# EAGLE design I2C-dluga-linia (EAGLE 7.3.0)
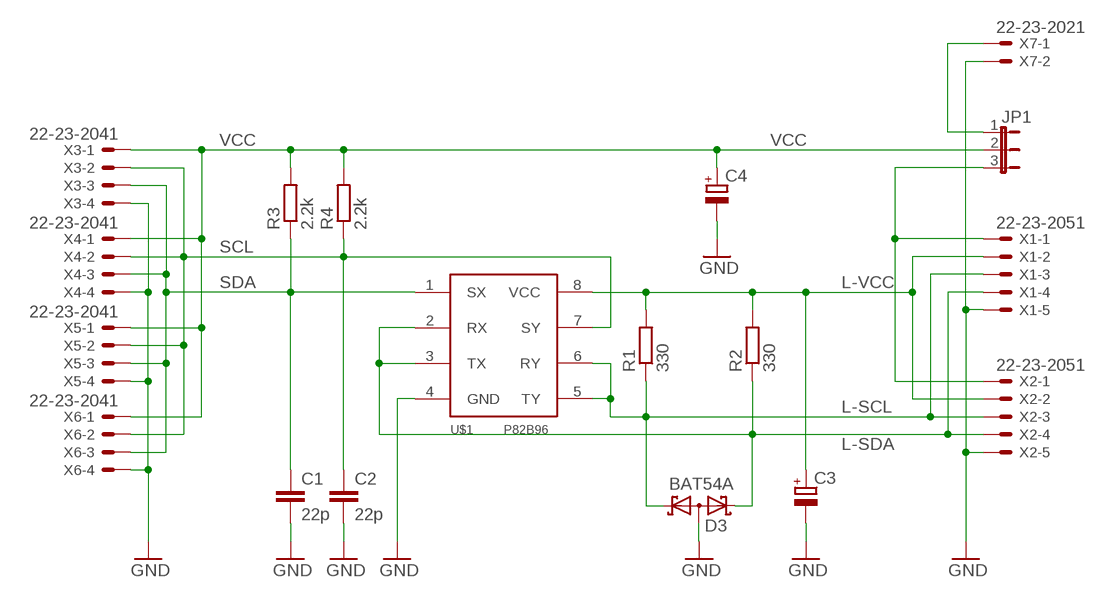
[diagram p0: schematic, sheet 1]

## Parts
C1  22p  C-EUC1206  [C1206]
C2  22p  C-EUC1206  [C1206]
C3  CPOL-EUE5-10.5  [E5-10,5]
C4  CPOL-EUE3.5-8  [E3,5-8]
D3  BAT54A  [SOT23]
JP1  JP2E  [JP2]
R1  330  R-EU_R1206  [R1206]
R2  330  R-EU_R1206  [R1206]
R3  2.2k  R-EU_R1206  [R1206]
R4  2.2k  R-EU_R1206  [R1206]
U$1  P82B96  [SOIC8]
X1  22-23-2051  [22-23-2051]
X2  22-23-2051  [22-23-2051]
X3  22-23-2041  [22-23-2041]
X4  22-23-2041  [22-23-2041]
X5  22-23-2041  [22-23-2041]
X6  22-23-2041  [22-23-2041]
X7  22-23-2021  [22-23-2021]

## Nets
GND: C1.2 C2.2 C3.- C4.- D3.3(AA) U$1.4(GND) X1.5 X2.5 X3.4 X4.4 X5.4 X6.4 X7.2
L-SCL: D3.1(K1) R1.1 U$1.5(TY) U$1.6(RY) X1.3 X2.3
L-SDA: D3.2(K2) R2.1 U$1.2(RX) U$1.3(TX) X1.4 X2.4
L-VCC: C3.+ R1.2 R2.2 U$1.8(VCC) X1.2 X2.2
N$1: JP1.3 X1.1 X2.1
N$2: JP1.1 X7.1
SCL: C2.1 R4.1 U$1.7(SY) X3.2 X4.2 X5.2 X6.2
SDA: C1.1 R3.1 U$1.1(SX) X3.3 X4.3 X5.3 X6.3
VCC: C4.+ JP1.2 R3.2 R4.2 X3.1 X4.1 X5.1 X6.1

## Library data of the parts
C1 C2 = rcl:C-EU: CAPACITOR, European symbol
C3 C4 = rcl:CPOL-EU: POLARIZED CAPACITOR, European symbol
D3 = diode:BAT54A: Schottky Diodes Source: Fairchild .. BAT54.pdf
JP1 = jumper:JP2E: JUMPER
R1-R4 = resistor:R-EU_: RESISTOR, European symbol
U$1 = P82B96:P82B96: P82B96 - I2C buffer
X1 X2 = con-molex:22-23-2051: .100" (2.54mm) Center Header - 5 Pin; MF: MOLEX; MPN: 22-23-2051; OC_FARNELL: 1462952; OC_NEWARK: 38C9178
X3-X6 = con-molex:22-23-2041: .100" (2.54mm) Center Header - 4 Pin; MF: MOLEX; MPN: 22-23-2041; OC_FARNELL: 1462920; OC_NEWARK: 38C0355
X7 = con-molex:22-23-2021: .100" (2.54mm) Center Header - 2 Pin; MF: MOLEX; MPN: 22-23-2021; OC_FARNELL: 1462926; OC_NEWARK: 25C3832

## Board
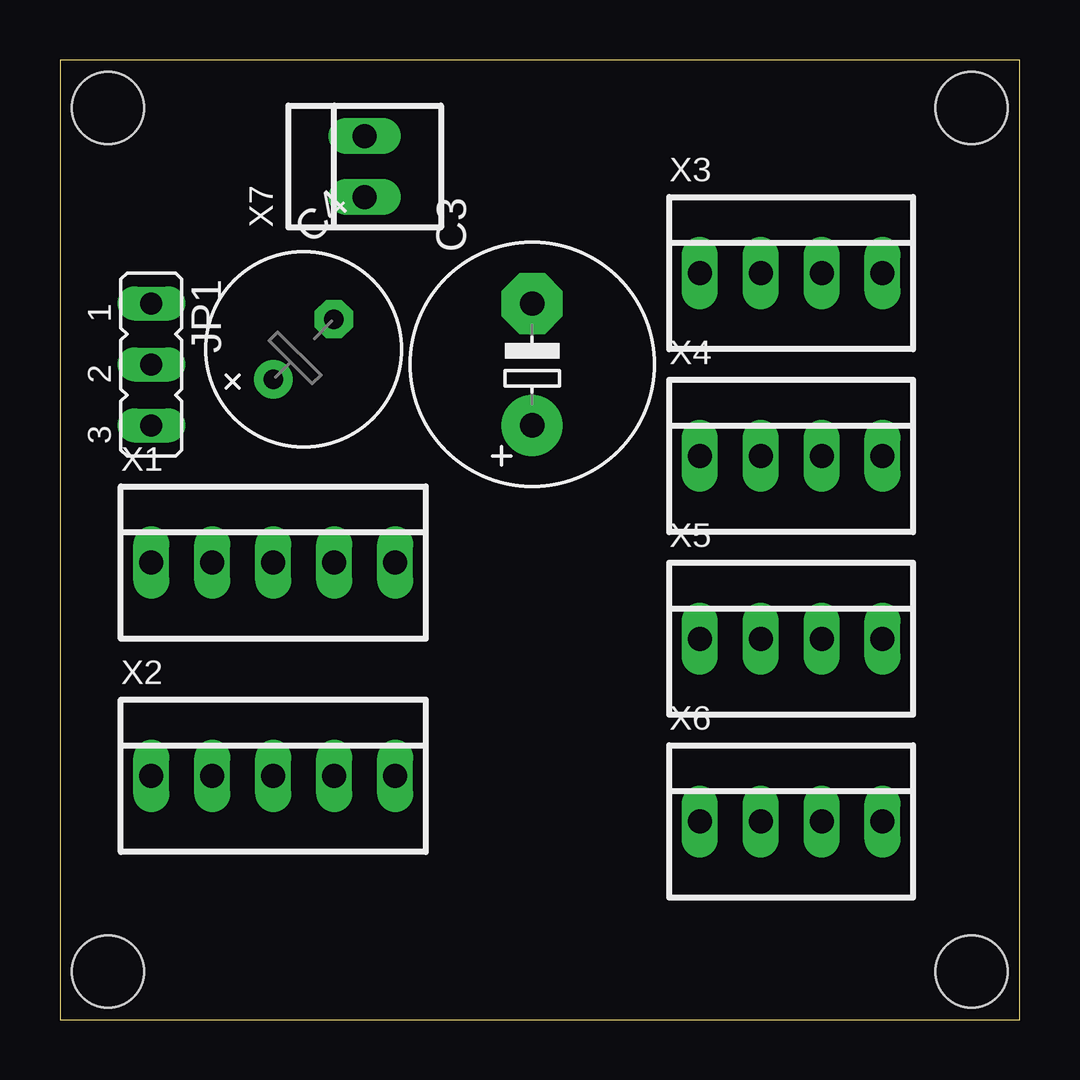
[diagram p1: board, top side]
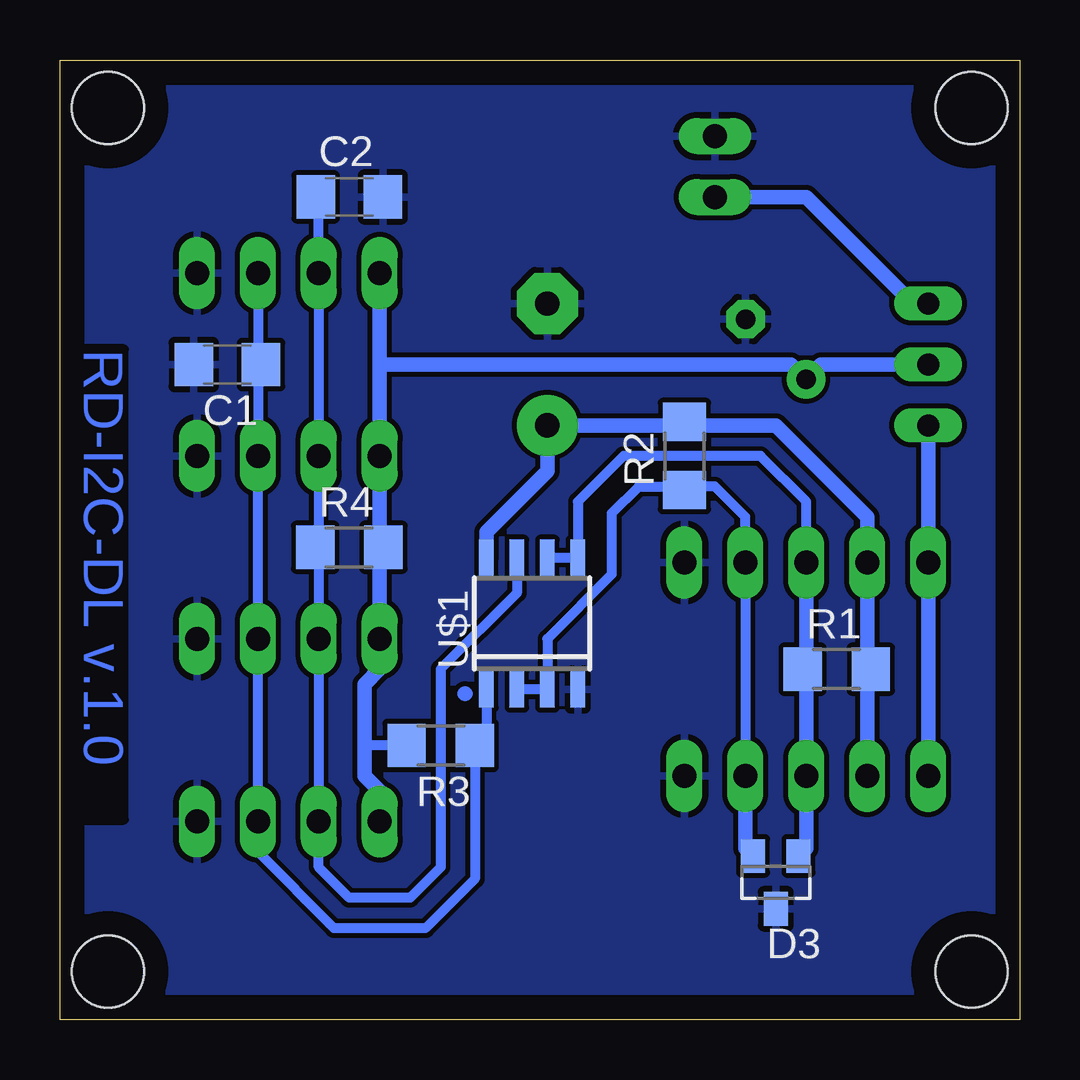
[diagram p2: board, bottom side, seen from below]

Size 40 x 40 mm. Coordinates in mm from the lower left corner, seen from the top.
Outline: 0,0 40,0 40,40 0,40 0,0
Copper layers (1*16): Top 0.035mm / dielectric 1.5mm / Bottom 0.035mm
Design rules "default *": minimum track width 10mil, minimum drill 24mil, track to track 8mil, track to pad 8mil, pad to pad 8mil, via to via 8mil, smd to smd 8mil, copper to edge 40mil, drill to drill 8mil, minimum pad ring 10mil, minimum via ring 8mil, stop-mask expansion 4mil, vias tented up to drill 0mil, thermal gap 10mil
Holes 3 mm at 2,2 2,38 38,38 38,2

### Footprints (pad centres in the part's own frame; a part is rotated, then mirrored left to right if it is on the bottom)
C1206 = smd 1.6 x 1.8: 1 -1.4,0; 2 1.4,0
E5-10,5 = drill 1.016 pad 2.54: + -2.54,0 | drill 1.016 pad 2.54 octagon: - 2.54,0
E3,5-8 = drill 0.813 pad 1.6: + -1.778,0 | drill 0.813 pad 1.6 octagon: - 1.778,0
SOT23 = smd 1 x 1.4: 1 -0.95,-1.1; 2 0.95,-1.1; 3 0,1.1
JP2 = drill 0.914 long: 1 -2.54,0; 2 0,0; 3 2.54,0
R1206 = smd 1.6 x 1.803: 1 -1.422,0; 2 1.422,0
SOIC8 = smd 0.6 x 1.5: 1 -1.905,-2.75; 2 -0.635,-2.75; 3 0.635,-2.75; 4 1.905,-2.75; 5 1.905,2.75; 6 0.635,2.75; 7 -0.635,2.75; 8 -1.905,2.75
22-23-2051 = drill 1 long: 1 -5.08,0; 2 -2.54,0; 3 0,0; 4 2.54,0; 5 5.08,0
22-23-2041 = drill 1 long: 1 -3.81,0; 2 -1.27,0; 3 1.27,0; 4 3.81,0
22-23-2021 = drill 1 long: 1 -1.27,0; 2 1.27,0

### Placement (x,y rotation side)
C1  33.02,27.3 180 bottom
C2  27.94,34.29 0 bottom
C3  19.68,27.3 90 top
C4  10.16,27.94 45 top
D3  10.16,5.71 180 bottom
JP1  3.81,27.3 270 top
R1  7.62,14.61 0 bottom
R2  13.97,23.5 90 bottom
R3  24.13,11.43 180 bottom
R4  27.94,19.68 0 bottom
U$1  20.32,16.51 0 bottom
X1  8.89,19.05 0 top
X2  8.89,10.16 0 top
X3  30.48,31.11 0 top
X4  30.48,23.5 0 top
X5  30.48,15.88 0 top
X6  30.48,8.26 0 top
X7  12.7,35.56 90 top

### Tracks (layer width: path | path; a pad name or v marks a point on that pad's centre or on a via)
GND
  pour Bottom: -0.64,40.64 -0.64,-0.64 40.64,-0.64 40.64,40.64
L-SCL
  Bottom 0.406: U$1.6 U$1.5 18.41,21.59 16.51,23.5 10.79,23.5 8.89,21.59 X1.3
  Bottom 0.61: X1.3 8.89,14.76 R1.1 8.89,14.45 X2.3 8.89,7.13 D3.1
L-SDA
  Bottom 0.406: U$1.2 U$1.3 19.68,15.88 16.99,18.57 16.99,21.11 15.88,22.23 14.12,22.23 | X2.4 X1.4 11.43,20.95 12.7,22.23 13.82,22.23 | 13.82,22.23 14.12,22.23 | 14.12,22.23 R2.1 13.82,22.23
  Bottom 0.61: X2.4 11.43,7.13 D3.2
L-VCC
  Bottom 0.61: U$1.8 22.23,20.32 19.68,22.86 C3.+ 14.12,24.77 R2.2 13.82,24.77 10.16,24.77 6.35,20.95 X1.2 6.35,14.76 R1.2 6.35,14.45 X2.2
N$1
  Bottom 0.61: X2.1 X1.1 JP1.3
N$2
  Bottom 0.61: JP1.1 4.45,29.84 8.89,34.29 X7.1
SCL
  Bottom 0.406: 29.21,19.68 X4.2 X3.2 29.21,34.16 C2.1 | 29.21,19.68 X5.2 X6.2 29.21,6.35 27.94,5.08 25.4,5.08 24.13,6.35 24.13,14.61 20.95,17.78 U$1.7 | R4.1 29.21,19.68
SDA
  Bottom 0.406: X3.3 31.75,27.3 | 31.75,27.3 X4.3 X5.3 X6.3 31.75,6.99 28.57,3.81 24.77,3.81 22.71,5.87 R3.1 22.23,11.91 U$1.1 | C1.1 31.75,27.3
VCC
  Bottom 0.406: R4.2 26.67,19.68 | R3.2 27.3,11.43
  Bottom 0.61: X6.1 26.67,9.53 27.3,10.16 27.3,11.43 27.3,13.97 26.67,14.61 X5.1 26.67,19.68 X4.1 26.67,27.3 | X3.1 26.67,27.3 | JP1.2 8.28,27.3 C4.+ 9.53,27.3 26.67,27.3
(copper drawn outside any net)
  shapes: Bottom circle x1

### Text on the board
Bottom: RD-I2C-DL v.1.0